# Altium schematic sheet 000_MCU.SchDoc
size A3; Organization: ORGANIZATION; Address1: ADDRESS 1; Address2: ADDRESS 2; Address3: ADDRESS 3; Address4: ADDRESS 4; Revision: -; SheetNumber: 4; SheetTotal: 4; ENG_APP_DATE: --/--/--; DSN_APP_DATE: --/--/--; CHK_APP_DATE: --/--/--
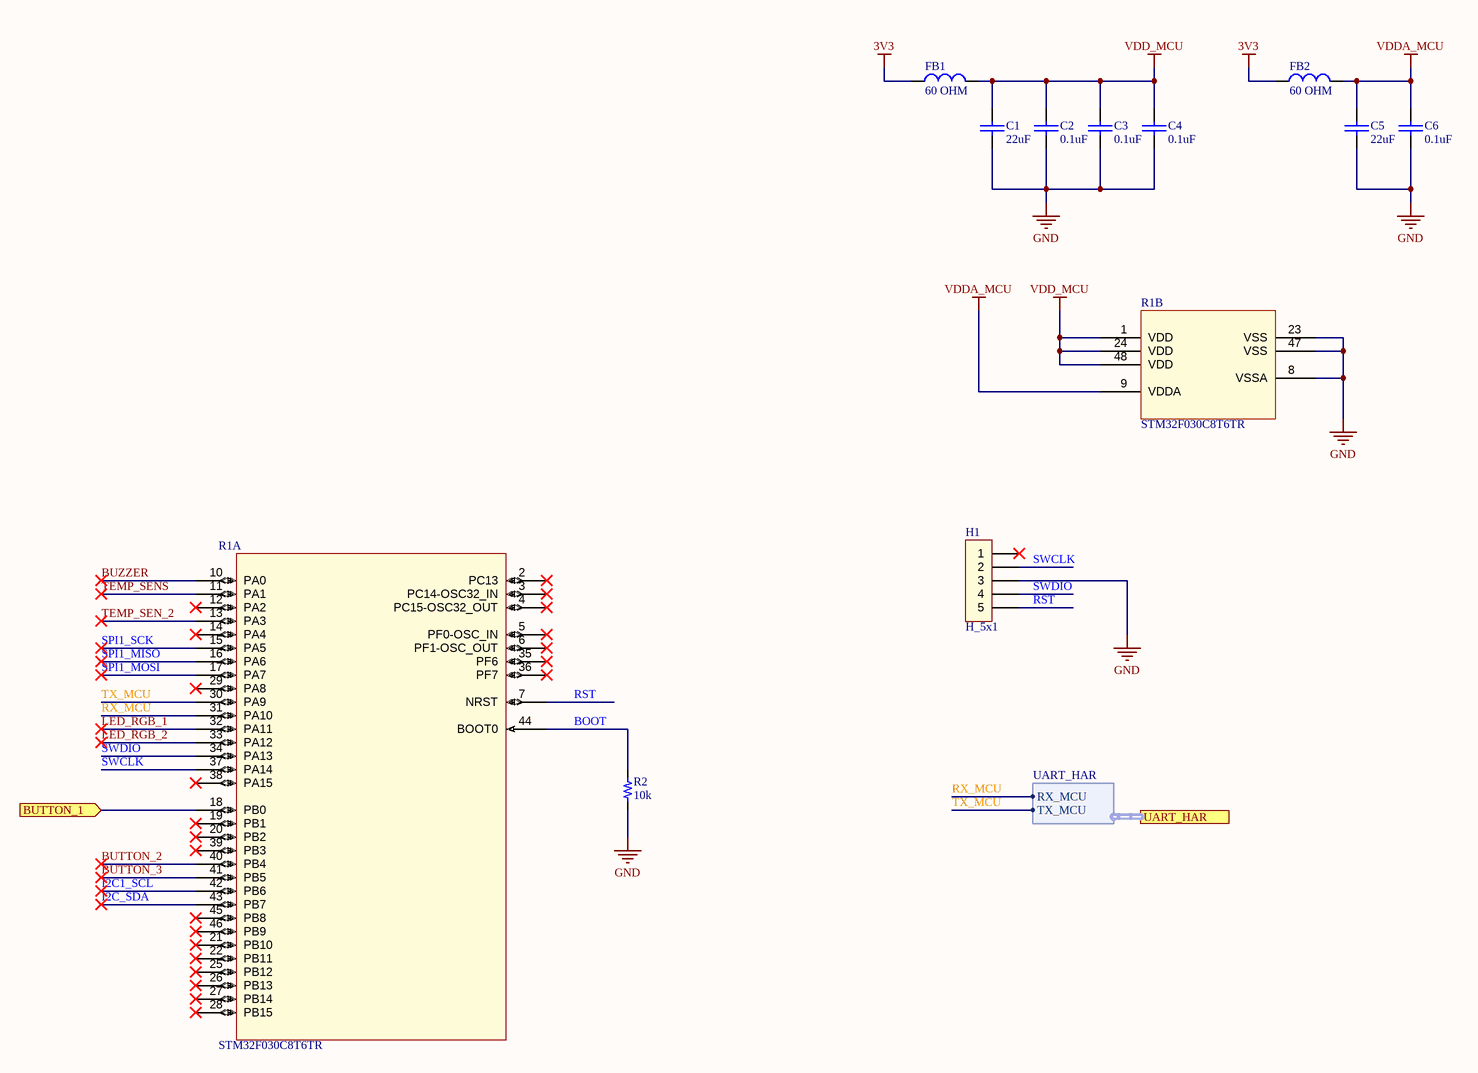
[diagram p0: 000_MCU.SchDoc]

## Parts
C1  value 22uF  [0603_cap]  (hidden comment: 22uF 6V3)
C2  value 0.1uF  [0603_cap]  (hidden comment: 0.1uF 50V)
C3  value 0.1uF  [0603_cap]  (hidden comment: 0.1uF 50V)
C4  value 0.1uF  [0603_cap]  (hidden comment: 0.1uF 50V)
C5  value 22uF  [0603_cap]  (hidden comment: 22uF 6V3)
C6  value 0.1uF  [0603_cap]  (hidden comment: 0.1uF 50V)
FB1  value 60 OHM  [0603_fb]  (hidden comment: 60OHM 2A)
FB2  value 60 OHM  [0603_fb]  (hidden comment: 60OHM 2A)
H1  H_5x1  [H_5x1_TH_100mil]  (no BOM)
R1  STM32F030C8T6TR  [LQFP48_7x7mm]  (parts A,B of 2)
R2  value 10k  [0603_res]  (hidden comment: 10k 1/10W)

## Ports
BUTTON_1 (in, see Main[2B], 100_POWER_AND LOADS[1D]), UART_HAR (harness UART_HAR, see Main[2A], 200_FLASH_AND_UART[3C])

## Harnesses
UART_HAR: RX_MCU, TX_MCU

## Nets
3V3: FB1.1 FB2.1
GND: C1.2 C2.2 C3.2 C4.2 C5.2 C6.2 H1.3 R1.8(VSSA) R1.23(VSS) R1.47(VSS) R2.1
VDD_MCU: C1.1 C2.1 C3.1 C4.1 FB1.2 R1.1(VDD) R1.24(VDD) R1.48(VDD)
VDDA_MCU: C5.1 C6.1 FB2.2 R1.9(VDDA)
BOOT: R1.44(BOOT0) R2.2
BUTTON_1: R1.18(PB0) ; port BUTTON_1
BUTTON_2: R1.40(PB4)
BUTTON_3: R1.41(PB5)
BUZZER: R1.10(PA0)
I2C1_SCL: R1.42(PB6)
I2C_SDA: R1.43(PB7)
LED_RGB_1: R1.32(PA11)
LED_RGB_2: R1.33(PA12)
RST: H1.5 R1.7(NRST)
RX_MCU: R1.31(PA10) ; port UART_HAR.RX_MCU
SPI1_MISO: R1.16(PA6)
SPI1_MOSI: R1.17(PA7)
SPI1_SCK: R1.15(PA5)
SWCLK: H1.2 R1.37(PA14)
SWDIO: H1.4 R1.34(PA13)
TEMP_SEN_2: R1.13(PA3)
TEMP_SENS: R1.11(PA1)
TX_MCU: R1.30(PA9) ; port UART_HAR.TX_MCU

Not connected (* = marked no-connect by the designer): H1 1*; R1 2(PC13)* 3(PC14-OSC32_IN)* 4(PC15-OSC32_OUT)* 5(PF0-OSC_IN)* 6(PF1-OSC_OUT)* 12(PA2)* 14(PA4)* 19(PB1)* 20(PB2)* 21(PB10)* 22(PB11)* 25(PB12)* 26(PB13)* 27(PB14)* 28(PB15)* 29(PA8)* 35(PF6)* 36(PF7)* 38(PA15)* 39(PB3)* 45(PB8)* 46(PB9)*

## Notes on the sheet
- DWG. NO.
- REV.
- SHT.
- THIS DOCUMENT AND THE DATA DISCLOSED HEREIN OR HEREWITH IS THE PROPERTY OF ALTIUM LIMITED AND MAY BE FREELY DISTRIBUTED IN WHOLE. NO RIGHTS ARE RESERVED OR EXPRESS OR IMPLIED WARANTEE GIVEN.
- REVISION
- DESCRIPTION
- DATE
- APPROVED
- ENG:
- APPROVALS
- PROJECT
- DSN:
- CHK:
- REFERENCE DOCUMENTS
- PROJECT REVISION:
- TITLE
- DOCUMENT REVISION:
- DESIGN ITEM:
- BOM:
- FAB DWG:
- PCB DWG:
- ASSY DWG:
- SCALE:
- SIZE
- B
- CAGE CODE
- FILE NAME
- DWG NO.
- SHEET
- OF
- REV

## Library data of the parts
C1 C5 = Cap_22uF_0805_6V3: 6.3V 22uF X5R ±20% 0805 Multilayer Ceramic Capacitors MLCC - SMD/SMT ROHS; Manufacturer: Samsung Electro-Mechanics; Manufacturer Part Number: CL21A226MQQNNNE; Supplier 1: LCSC; Supplier Part Number 1: C5674; ComponentLink1Description: LCSC; ComponentLink1URL: https://www.lcsc.com/product-detail/Multilayer-Ceramic-Capacitors-MLCC-SMD-SMT_Samsung-Electro-Mechanics-CL21A226MQQNNNE_C5674.html
C2-C4 C6 = Cap_0.1uF_0603_50V: 50V 100nF Y5V -20%~+80% 0603 Multilayer Ceramic Capacitors MLCC - SMD/SMT ROHS; Manufacturer: Walsin Tech Corp; Manufacturer Part Number: 0603F104Z500CT; Supplier 1: LCSC; Supplier Part Number 1: C83060; ComponentLink1Description: LCSC; ComponentLink1URL: https://www.lcsc.com/product-detail/Multilayer-Ceramic-Capacitors-MLCC-SMD-SMT_Walsin-Tech-Corp-0603F104Z500CT_C83060.html
FB1 FB2 = FB_60_0603_2A: 2A 1 100mΩ 60Ω@100MHz ±25% 0603 Ferrite Beads ROHS; Manufacturer: TAI-TECH; Manufacturer Part Number: HCB1608KF-600T20; ComponentLink1Description: LCSC; ComponentLink1URL: https://www.lcsc.com/product-detail/Ferrite-Beads_TAI-TECH-HCB1608KF-600T20_C369516.html; Supplier 1: LCSC; Supplier Part Number 1: C369516
H1 = H_Male_5x1_TH_100mil: Debugging male pin; Last modified by: C-A.Serna.A; Last modified date: 20190225
R1 = IC_STM32F030C8T6TR_LQFP48_7x7MM: IC MCU 32BIT 64KB FLASH 48LQFP; Manufacturer: STMicroelectronics; Manufacturer part number: STM32F030C8T6TR; Supplier 1: LCSC; Supplier Part Number 1: C23922; ComponentLink1Description: LCSC; ComponentLink1URL: https://www.lcsc.com/product-detail/ST-Microelectronics_STMicroelectronics-STM32F030C8T6_C23922.html
R2 = Res_10k_0603_1/10W: RES SMD 10k OHM 5% 1/10W 0603; Manufacturer: FOJAN; Manufacturer Part Number: FRC0603J103TS; ComponentLink1URL: https://www.lcsc.com/product-detail/Chip-Resistor-Surface-Mount_FOJAN-FRC0603J103TS_C2930027.html; Supplier 1: LCSC; Supplier Part Number 1: C2930027; ComponentLink1Description: LCSC